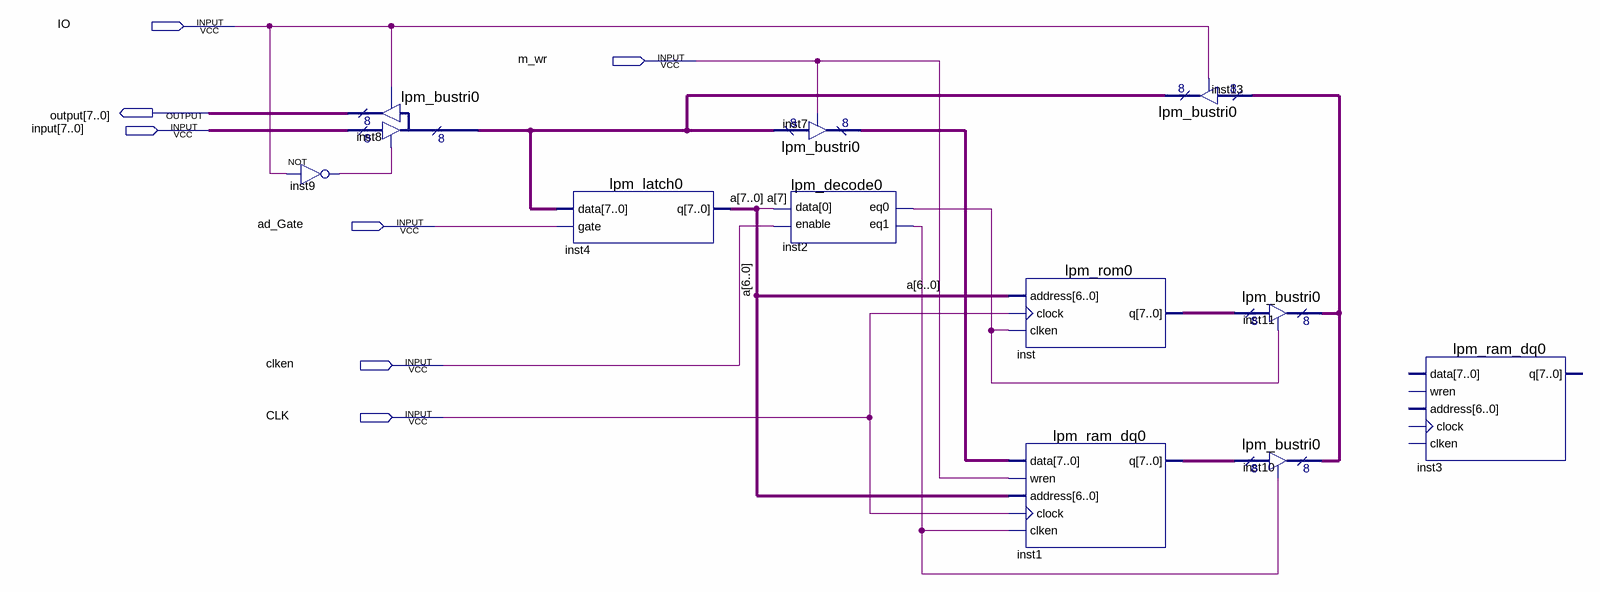
[diagram p0: schematic sheet]
// Quartus schematic COS_LAB3.bdf as structural Verilog: 11 symbols, 7 pins
module COS_LAB3 (
  input  IO,
  input  m_wr,
  input  [7:0] \input ,
  input  ad_Gate,
  input  clken,
  input  CLK,
  output [7:0] \output 
);

  wire inst2_eq0, inst2_eq1, inst9_out;
  wire [7:0] a, inst1_q, inst7_tridata, inst8_tridata, inst11_tridata, inst_q;

  not inst9 (inst9_out, IO);
  lpm_bustri0 inst8 (.enabledt(inst9_out), .data(\input ), .enabletr(IO), .result(\output ), .tridata(inst8_tridata));
  lpm_latch0 inst4 (.data(inst8_tridata), .gate(ad_Gate), .q(a));
  lpm_bustri0 inst7 (.enabledt(m_wr), .data(inst8_tridata), .tridata(inst7_tridata));
  lpm_decode0 inst2 (.data(a[7]), .enable(clken), .eq0(inst2_eq0), .eq1(inst2_eq1));
  lpm_rom0 inst (.address(a[6:0]), .clock(CLK), .clken(inst2_eq0), .q(inst_q));
  lpm_ram_dq0 inst1 (.data(inst7_tridata), .wren(m_wr), .address(a[6:0]), .clock(CLK), .clken(inst2_eq1), .q(inst1_q));
  lpm_bustri0 inst13 (.enabledt(IO), .data(inst11_tridata), .tridata(inst8_tridata));
  lpm_bustri0 inst11 (.enabledt(inst2_eq0), .data(inst_q), .tridata(inst11_tridata));
  lpm_bustri0 inst10 (.enabledt(inst2_eq1), .data(inst1_q), .tridata(inst11_tridata));
  lpm_ram_dq0 inst3 ();  // open: data, wren, address, clock, clken, q
endmodule
